# Altium schematic sheet POWER.SchDoc: LED Cube 8x8x8 - POWER
size A4; Author: Luka Penger; CompanyName: L. Penger; DrawnBy: Luka Penger; Organization: L. Penger; Address1: Luka Penger; Address2: http://lukapenger.eu; Address3: Software & Hardware; Address4: Development; DocumentNumber: 4; Revision: 4.1.0; SheetNumber: 4; SheetTotal: 4; DocumentName: POWER; ProjectName: LED Cube 8x8x8
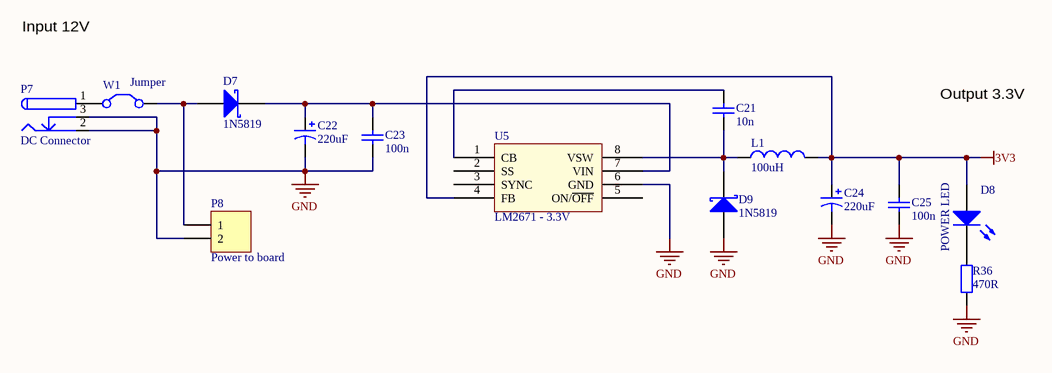
[diagram p0: POWER.SchDoc]

## Parts
C21  10n  [1608[0603]]
C22  220uF  [SMD CAPACITOR 220uF]
C23  100n  [1608[0603]]
C24  220uF  [SMD CAPACITOR 220uF]
C25  100n  [1608[0603]]
D7  1N5819  [DO-214AC (SMA)]
D8  POWER LED  [LED-1]
D9  1N5819  [DO-214AC (SMA)]
L1  100uH  [SDR0805-101KL]
P7  DC Connector  [DC Connector]
P8  Power to board  [Block2 - 3.81]
R36  470R  [1608[0603]]
U5  LM2671 - 3.3V  [SOIC8_Narrow]
W1  Jumper  [HDR1X2]

## Nets
3V3: C24.1 C25.1 D8.1(A) L1.2 U5.4(FB)
GND: C22.2 C23.2 C24.2 C25.2 D9.1(A) P7.2 P7.3 P8.2 R36.1 U5.6(GND)
NetC21_1: C21.1 D9.2(K) L1.1 U5.8(VSW)
NetC21_2: C21.2 U5.1(CB)
NetC22_1: C22.1 C23.1 D7.2(K) U5.7(VIN)
NetD7_1: D7.1(A) P8.1 W1.2(C2)
NetD8_2: D8.2(K) R36.2
NetP7_1: P7.1 W1.1(C1)

Not connected (* = marked no-connect by the designer): U5 2(SS) 3(SYNC) 5(ON/~{OFF})

## Notes on the sheet
- Input 12V
- Output 3.3V
- Title
- Size:
- Date:
- A4
- Number:
- Time:
- Revision:
- Sheet
- of
- File:

## Library data of the parts
C21 C23 C25 = Cap: Capacitor; Value: 100pF; Published: 8-Jun-2000; LatestRevisionDate: 17-Jul-2002; LatestRevisionNote: Re-released for DXP Platform.; PackageReference: RAD-0.3; Publisher: Altium Limited; PackageDescription: Radial Cap, Thru-Hole; 2 Leads; 0.3 in Pin Spacing
C22 C24 = Cap Pol1: Capacitor; Value: 100pF; Published: 8-Jun-2000; LatestRevisionDate: 17-Jul-2002; LatestRevisionNote: Re-released for DXP Platform.; PackageReference: RB7.6-15; Publisher: Altium Limited; PackageDescription: Polarized Capacitor (Radial); 2 Leads
D7 D9 = D Schottky: Schottky Diode; Published: 8-Jun-2000; LatestRevisionDate: 17-Jul-2002; LatestRevisionNote: Re-released for DXP Platform.; PackageReference: SMB; Publisher: Altium Limited; PackageDescription: DO-214-AA/SMB; 2 C-Bend Leads; Body 5.3 x 3.6 mm, inc. leads (LxW); Code_JEDEC: DO-214-AA
D8 = LED0: Typical INFRARED GaAs LED; Published: 8-Jun-2000; LatestRevisionDate: 08-Jul-2005; LatestRevisionNote: Mech Layer 1 removed.; PackageReference: LED-0; Publisher: Altium Limited; PackageDescription: LED; 2 Leads
L1 = Inductor: Code_IEC: 1005; Value: 10mH; Published: 8-Jun-2000; LatestRevisionDate: 29-May-2009; LatestRevisionNote: IPC-7351 Footprint Added.; PackageReference: 0402-A; Publisher: Altium Limited; PackageDescription: Chip Inductor; Code_JEITA: 0402
P7 = DC Connector: DC Power Connector
P8 = Header 2: Header, 2-Pin; LatestRevisionDate: 17-Jul-2002; LatestRevisionNote: Re-released for DXP Platform.; Publisher: Altium Limited
R36 = Res2: Resistor; Value: 1K; Published: 8-Jun-2000; LatestRevisionDate: 17-Jul-2002; LatestRevisionNote: Re-released for DXP Platform.; PackageReference: AXIAL-0.4; Publisher: Altium Limited; PackageDescription: Axial Device, Thru-Hole; 2 Leads; 0.4 in Pin Spacing
U5 = LM2671: Switcher Voltage  Regulator
W1 = Jumper: Jumper Wire; Published: 24-Mar-1999; LatestRevisionDate: 17-Jul-2002; LatestRevisionNote: Re-released for DXP Platform.; PackageReference: RAD-0.2; Publisher: Altium Limited; PackageDescription: Radial Cap, Thru-Hole; 2 Leads; 0.2 in Pin Spacing